# EAGLE schematic sch (EAGLE 7.4.0)
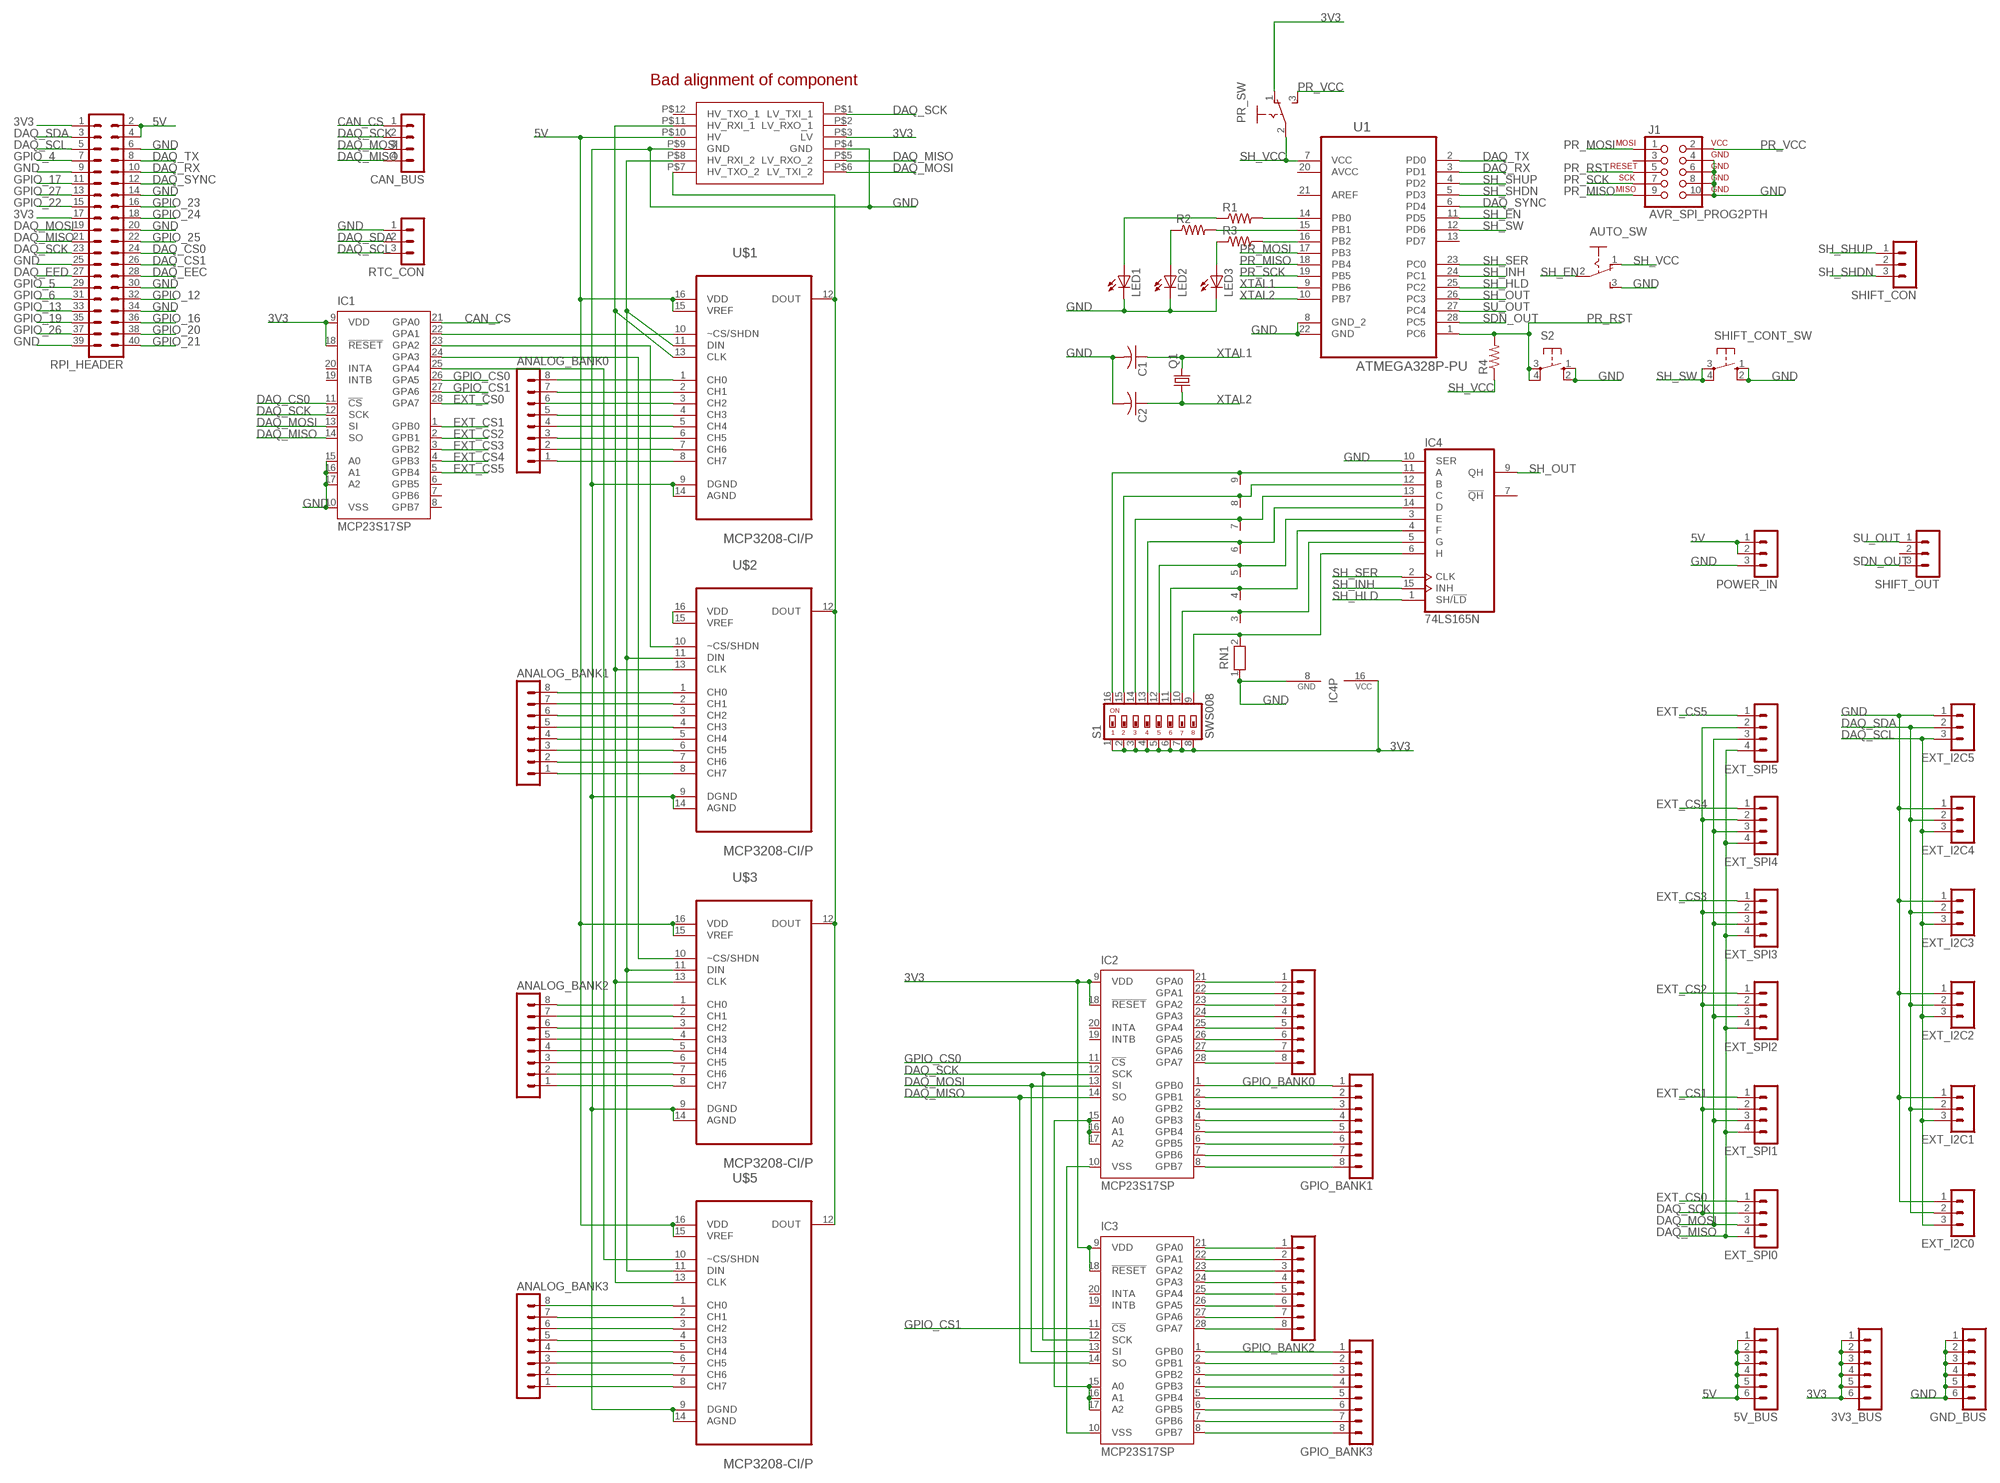
[diagram p0: schematic, sheet 1]

## Parts
3V3_BUS  MA06-1  [MA06-1]
5V_BUS  MA06-1  [MA06-1]
ANALOG_BANK0  MA08-1  [MA08-1]
ANALOG_BANK1  MA08-1  [MA08-1]
ANALOG_BANK2  MA08-1  [MA08-1]
ANALOG_BANK3  MA08-1  [MA08-1]
AUTO_SW  255SB  [255SB]
C1  C-US025-025X050  [C025-025X050]
C2  C-US025-025X050  [C025-025X050]
CAN_BUS  MA04-1  [MA04-1]
EXT_I2C0  MA03-1  [MA03-1]
EXT_I2C1  MA03-1  [MA03-1]
EXT_I2C2  MA03-1  [MA03-1]
EXT_I2C3  MA03-1  [MA03-1]
EXT_I2C4  MA03-1  [MA03-1]
EXT_I2C5  MA03-1  [MA03-1]
EXT_SPI0  MA04-1  [MA04-1]
EXT_SPI1  MA04-1  [MA04-1]
EXT_SPI2  MA04-1  [MA04-1]
EXT_SPI3  MA04-1  [MA04-1]
EXT_SPI4  MA04-1  [MA04-1]
EXT_SPI5  MA04-1  [MA04-1]
GND_BUS  MA06-1  [MA06-1]
GPIO_BANK0  MA08-1  [MA08-1]
GPIO_BANK1  MA08-1  [MA08-1]
GPIO_BANK2  MA08-1  [MA08-1]
GPIO_BANK3  MA08-1  [MA08-1]
IC1  MCP23S17SP  [DIL28-3]
IC2  MCP23S17SP  [DIL28-3]
IC3  MCP23S17SP  [DIL28-3]
IC4  74LS165N  [DIL16]
J1  AVR_SPI_PROG2PTH  [AVR_ICSP]
LED1  LED3MM  [LED3MM]
LED2  LED3MM  [LED3MM]
LED3  LED3MM  [LED3MM]
POWER_IN  MA03-1  [MA03-1]
PR_SW  255SB  [255SB]
Q1  CRYSTALHC49S  [HC49/S]
R1  R-US_0204/5  [0204/5]
R2  R-US_0204/5  [0204/5]
R3  R-US_0204/5  [0204/5]
R4  R-US_0204/5  [0204/5]
RN1  RN08  [RN-9]
RPI_HEADER  MA20-2  [MA20-2]
RTC_CON  MA03-1  [MA03-1]
S1  SWS008  [SMS-008]
S2  10-XX  [B3F-10XX]
SHIFT_CON  MA03-1  [MA03-1]
SHIFT_CONT_SW  10-XX  [B3F-10XX]
SHIFT_OUT  MA03-1  [MA03-1]
U1  ATMEGA328P-PU  [DIP254P762X457-28]
U$1  MCP3208-CI/P  [DIP254P762X432-16]
U$2  MCP3208-CI/P  [DIP254P762X432-16]
U$3  MCP3208-CI/P  [DIP254P762X432-16]
U$4  LOGIC_LEVEL_CONVERTER  [LOGIC_LEVEL_CONVERTER]
U$5  MCP3208-CI/P  [DIP254P762X432-16]

## Nets
3V3: 3V3_BUS.1 3V3_BUS.2 3V3_BUS.3 3V3_BUS.4 3V3_BUS.5 3V3_BUS.6 IC1.9(VDD) IC1.18(!RESET) IC2.9(VDD) IC2.18(!RESET) IC3.9(VDD) IC3.18(!RESET) IC4.16(VCC) PR_SW.1(O) RPI_HEADER.1 RPI_HEADER.17 S1.1 S1.2 S1.3 S1.4 S1.5 S1.6 S1.7 S1.8 U$4.P$3(LV)
5V: 5V_BUS.1 5V_BUS.2 5V_BUS.3 5V_BUS.4 5V_BUS.5 5V_BUS.6 POWER_IN.1 POWER_IN.2 RPI_HEADER.2 RPI_HEADER.4 U$1.15(VREF) U$1.16(VDD) U$3.15(VREF) U$3.16(VDD) U$4.P$10(HV) U$5.15(VREF) U$5.16(VDD)
CAN_CS: CAN_BUS.1 IC1.21(GPA0)
DAQ_CS0: IC1.11(!CS) RPI_HEADER.24
DAQ_CS1: RPI_HEADER.26
DAQ_EEC: RPI_HEADER.28
DAQ_EED: RPI_HEADER.27
DAQ_MISO: CAN_BUS.4 EXT_SPI0.4 EXT_SPI1.4 EXT_SPI2.4 EXT_SPI3.4 EXT_SPI4.4 EXT_SPI5.4 IC1.14(SO) IC2.14(SO) IC3.14(SO) RPI_HEADER.21 U$4.P$5(LV_RXO_2)
DAQ_MOSI: CAN_BUS.3 EXT_SPI0.3 EXT_SPI1.3 EXT_SPI2.3 EXT_SPI3.3 EXT_SPI4.3 EXT_SPI5.3 IC1.13(SI) IC2.13(SI) IC3.13(SI) RPI_HEADER.19 U$4.P$6(LV_TXI_2)
DAQ_RX: RPI_HEADER.10 U1.3(PD1)
DAQ_SCK: CAN_BUS.2 EXT_SPI0.2 EXT_SPI1.2 EXT_SPI2.2 EXT_SPI3.2 EXT_SPI4.2 EXT_SPI5.2 IC1.12(SCK) IC2.12(SCK) IC3.12(SCK) RPI_HEADER.23 U$4.P$1(LV_TXI_1)
DAQ_SCL: EXT_I2C0.3 EXT_I2C1.3 EXT_I2C2.3 EXT_I2C3.3 EXT_I2C4.3 EXT_I2C5.3 RPI_HEADER.5 RTC_CON.3
DAQ_SDA: EXT_I2C0.2 EXT_I2C1.2 EXT_I2C2.2 EXT_I2C3.2 EXT_I2C4.2 EXT_I2C5.2 RPI_HEADER.3 RTC_CON.2
DAQ_SYNC: RPI_HEADER.12 U1.6(PD4)
DAQ_TX: RPI_HEADER.8 U1.2(PD0)
EXT_CS0: EXT_SPI0.1 IC1.28(GPA7)
EXT_CS1: EXT_SPI1.1 IC1.1(GPB0)
EXT_CS2: EXT_SPI2.1 IC1.2(GPB1)
EXT_CS3: EXT_SPI3.1 IC1.3(GPB2)
EXT_CS4: EXT_SPI4.1 IC1.4(GPB3)
EXT_CS5: EXT_SPI5.1 IC1.5(GPB4)
GND: AUTO_SW.3(S) C1.2 C2.2 EXT_I2C0.1 EXT_I2C1.1 EXT_I2C2.1 EXT_I2C3.1 EXT_I2C4.1 EXT_I2C5.1 GND_BUS.1 GND_BUS.2 GND_BUS.3 GND_BUS.4 GND_BUS.5 GND_BUS.6 IC1.10(VSS) IC1.15(A0) IC1.16(A1) IC1.17(A2) IC4.8(GND) IC4.10(SER) J1.4(GND) J1.6(GND) J1.8(GND) J1.10(GND) LED1.K(C) LED2.K(C) LED3.K(C) POWER_IN.3 RN1.1 RPI_HEADER.6 RPI_HEADER.9 RPI_HEADER.14 RPI_HEADER.20 RPI_HEADER.25 RPI_HEADER.30 RPI_HEADER.34 RPI_HEADER.39 RTC_CON.1 S2.1(S) S2.2(S1) SHIFT_CONT_SW.1(S) SHIFT_CONT_SW.2(S1) U1.8(GND_2) U1.22(GND) U$1.9(DGND) U$1.14(AGND) U$2.9(DGND) U$2.14(AGND) U$3.9(DGND) U$3.14(AGND) U$4.P$4(GND) U$4.P$9(GND) U$5.9(DGND) U$5.14(AGND)
GPIO_4: RPI_HEADER.7
GPIO_5: RPI_HEADER.29
GPIO_6: RPI_HEADER.31
GPIO_12: RPI_HEADER.32
GPIO_13: RPI_HEADER.33
GPIO_16: RPI_HEADER.36
GPIO_17: RPI_HEADER.11
GPIO_19: RPI_HEADER.35
GPIO_20: RPI_HEADER.38
GPIO_21: RPI_HEADER.40
GPIO_22: RPI_HEADER.15
GPIO_23: RPI_HEADER.16
GPIO_24: RPI_HEADER.18
GPIO_25: RPI_HEADER.22
GPIO_26: RPI_HEADER.37
GPIO_27: RPI_HEADER.13
GPIO_CS0: IC1.26(GPA5) IC2.11(!CS)
GPIO_CS1: IC1.27(GPA6) IC3.11(!CS)
N$1: GPIO_BANK2.1 IC3.21(GPA0)
N$2: GPIO_BANK2.2 IC3.22(GPA1)
N$3: GPIO_BANK2.3 IC3.23(GPA2)
N$4: IC2.10(VSS) IC3.10(VSS)
N$5: U$2.15(VREF) U$2.16(VDD)
N$6: IC2.15(A0) IC2.16(A1) IC2.17(A2) IC3.15(A0) IC3.16(A1) IC3.17(A2)
N$7: IC1.22(GPA1) U$1.10(~CS/SHDN)
N$8: IC1.23(GPA2) U$2.10(~CS/SHDN)
N$9: IC1.24(GPA3) U$3.10(~CS/SHDN)
N$10: IC4.11(A) RN1.9 S1.16
N$11: IC4.12(B) RN1.8 S1.15
N$12: IC4.13(C) RN1.7 S1.14
N$13: IC4.14(D) RN1.6 S1.13
N$14: IC4.3(E) RN1.5 S1.12
N$15: IC4.4(F) RN1.4 S1.11
N$16: IC4.5(G) RN1.3 S1.10
N$17: IC4.6(H) RN1.2 S1.9
N$20: GPIO_BANK2.4 IC3.24(GPA3)
N$21: GPIO_BANK2.5 IC3.25(GPA4)
N$22: GPIO_BANK2.6 IC3.26(GPA5)
N$23: LED3.A R3.1
N$24: LED2.A R2.1
N$25: LED1.A R1.1
N$26: R1.2 U1.14(PB0)
N$27: R2.2 U1.15(PB1)
N$28: R3.2 U1.16(PB2)
N$29: GPIO_BANK2.7 IC3.27(GPA6)
N$30: U$1.12(DOUT) U$2.12(DOUT) U$3.12(DOUT) U$4.P$7(HV_TXO_2) U$5.12(DOUT)
N$31: U$1.11(DIN) U$2.11(DIN) U$3.11(DIN) U$4.P$8(HV_RXI_2) U$5.11(DIN)
N$32: U$1.13(CLK) U$2.13(CLK) U$3.13(CLK) U$4.P$11(HV_RXI_1) U$5.13(CLK)
N$33: GPIO_BANK2.8 IC3.28(GPA7)
N$34: GPIO_BANK3.1 IC3.1(GPB0)
N$35: GPIO_BANK3.2 IC3.2(GPB1)
N$36: IC1.25(GPA4) U$5.10(~CS/SHDN)
N$37: GPIO_BANK3.3 IC3.3(GPB2)
N$38: GPIO_BANK3.4 IC3.4(GPB3)
N$39: GPIO_BANK3.5 IC3.5(GPB4)
N$40: GPIO_BANK3.6 IC3.6(GPB5)
N$41: GPIO_BANK3.7 IC3.7(GPB6)
N$42: GPIO_BANK3.8 IC3.8(GPB7)
N$43: GPIO_BANK1.8 IC2.8(GPB7)
N$44: GPIO_BANK1.7 IC2.7(GPB6)
N$45: GPIO_BANK1.6 IC2.6(GPB5)
N$46: GPIO_BANK1.5 IC2.5(GPB4)
N$47: GPIO_BANK1.4 IC2.4(GPB3)
N$48: GPIO_BANK1.3 IC2.3(GPB2)
N$49: GPIO_BANK1.2 IC2.2(GPB1)
N$50: GPIO_BANK1.1 IC2.1(GPB0)
N$51: GPIO_BANK0.8 IC2.28(GPA7)
N$52: GPIO_BANK0.7 IC2.27(GPA6)
N$53: GPIO_BANK0.6 IC2.26(GPA5)
N$54: GPIO_BANK0.5 IC2.25(GPA4)
N$55: GPIO_BANK0.4 IC2.24(GPA3)
N$56: GPIO_BANK0.3 IC2.23(GPA2)
N$57: GPIO_BANK0.2 IC2.22(GPA1)
N$58: GPIO_BANK0.1 IC2.21(GPA0)
N$59: U$5.1(CH0)
N$60: ANALOG_BANK3.7 U$5.2(CH1)
N$61: ANALOG_BANK3.6 U$5.3(CH2)
N$62: ANALOG_BANK3.5 U$5.4(CH3)
N$63: ANALOG_BANK3.4 U$5.5(CH4)
N$64: ANALOG_BANK3.3 U$5.6(CH5)
N$65: ANALOG_BANK3.2 U$5.7(CH6)
N$66: ANALOG_BANK3.1 U$5.8(CH7)
N$67: ANALOG_BANK2.1 U$3.8(CH7)
N$68: ANALOG_BANK2.2 U$3.7(CH6)
N$69: ANALOG_BANK2.3 U$3.6(CH5)
N$70: ANALOG_BANK2.4 U$3.5(CH4)
N$71: ANALOG_BANK2.5 U$3.4(CH3)
N$72: ANALOG_BANK2.6 U$3.3(CH2)
N$73: ANALOG_BANK2.7 U$3.2(CH1)
N$74: ANALOG_BANK2.8 U$3.1(CH0)
N$75: ANALOG_BANK1.1 U$2.8(CH7)
N$76: ANALOG_BANK1.2 U$2.7(CH6)
N$77: ANALOG_BANK1.3 U$2.6(CH5)
N$78: ANALOG_BANK1.4 U$2.5(CH4)
N$79: ANALOG_BANK1.5 U$2.4(CH3)
N$80: ANALOG_BANK1.6 U$2.3(CH2)
N$81: ANALOG_BANK1.7 U$2.2(CH1)
N$82: ANALOG_BANK1.8 U$2.1(CH0)
N$83: ANALOG_BANK0.1 U$1.8(CH7)
N$84: ANALOG_BANK0.2 U$1.7(CH6)
N$85: ANALOG_BANK0.3 U$1.6(CH5)
N$86: ANALOG_BANK0.4 U$1.5(CH4)
N$87: ANALOG_BANK0.5 U$1.4(CH3)
N$88: U$1.3(CH2)
N$89: ANALOG_BANK0.7 U$1.2(CH1)
N$90: ANALOG_BANK0.8 U$1.1(CH0)
PR_MISO: J1.9(MISO) U1.18(PB4)
PR_MOSI: J1.1(MOSI) U1.17(PB3)
PR_RST: J1.5(RESET) R4.2 S2.3(P) S2.4(P1) U1.1(PC6)
PR_SCK: J1.7(SCK) U1.19(PB5)
PR_VCC: J1.2(VCC) PR_SW.3(S)
SDN_OUT: SHIFT_OUT.3 U1.28(PC5)
SH_EN: AUTO_SW.2(P) U1.11(PD5)
SH_HLD: IC4.1(SH/!LD) U1.25(PC2)
SH_INH: IC4.15(INH) U1.24(PC1)
SH_OUT: IC4.9(QH) U1.26(PC3)
SH_SER: IC4.2(CLK) U1.23(PC0)
SH_SHDN: SHIFT_CON.3 U1.5(PD3)
SH_SHUP: SHIFT_CON.1 U1.4(PD2)
SH_SW: SHIFT_CONT_SW.3(P) SHIFT_CONT_SW.4(P1) U1.12(PD6)
SH_VCC: AUTO_SW.1(O) PR_SW.2(P) R4.1 U1.7(VCC)
SU_OUT: SHIFT_OUT.1 U1.27(PC4)
XTAL1: C1.1 Q1.2 U1.9(PB6)
XTAL2: C2.1 Q1.1 U1.10(PB7)
Unconnected: ANALOG_BANK0.6 ANALOG_BANK3.8 IC1.6(GPB5) IC1.7(GPB6) IC1.8(GPB7) IC1.19(INTB) IC1.20(INTA) IC2.19(INTB) IC2.20(INTA) IC3.19(INTB) IC3.20(INTA) IC4.7(!QH) J1.3(NC) SHIFT_CON.2 SHIFT_OUT.2 U1.13(PD7) U1.21(AREF) U$4.P$2(LV_RXO_1) U$4.P$12(HV_TXO_1)

## Notes on the sheet
- Bad alignment of component

## Power pins joined to a net without a drawn wire
AVCC: U1.20(AVCC)

## Library data of the parts
3V3_BUS 5V_BUS GND_BUS = con-lstb:MA06-1: PIN HEADER; OC_FARNELL: unknown; OC_NEWARK: unknown
ANALOG_BANK0 ANALOG_BANK1-ANALOG_BANK3 GPIO_BANK0 GPIO_BANK1-GPIO_BANK3 = con-lstb:MA08-1: PIN HEADER; OC_FARNELL: unknown; OC_NEWARK: unknown
AUTO_SW PR_SW = switch:255SB: SLIDING SWITCH Distributor Buerklin, 11G810
C1 C2 = rcl:C-US: CAPACITOR, American symbol
CAN_BUS EXT_SPI0 EXT_SPI1-EXT_SPI5 = con-lstb:MA04-1: PIN HEADER; OC_FARNELL: unknown; OC_NEWARK: unknown
EXT_I2C0 EXT_I2C1-EXT_I2C5 POWER_IN RTC_CON SHIFT_CON SHIFT_OUT = con-lstb:MA03-1: PIN HEADER; OC_FARNELL: unknown; OC_NEWARK: unknown
IC1-IC3 = microchip:MCP23S17: http://ww1.microchip.com/downloads/en/DeviceDoc/21952a.pdf Source: http://ww1.microchip.com/downloads/en/DeviceDoc/21952a.pdf; MF: MICROCHIP; MPN: MCP23S17-E/SP; OC_FARNELL: 1292238; OC_NEWARK: 31K2951
IC4 = 74xx-us:74*165: 8-bit parallel load SHIFT REGISTER
J1 = SparkFun-Connectors:AVR_SPI_PROG2: AVR 10-pin ICSP Header This is the standard AVR In Circuit Serial Programming header. Minimal, but includes pin one indicator. Works with standard Olimex programmers. Also look for the 6-pin reduced version. Spark Fun Electronics SKU: PRT-00778
LED1-LED3 = led:LED: LED OSRAM: - CHIPLED LG R971, LG N971, LY N971, LG Q971, LY Q971, LO R971, LY R971 LH N974, LH R974 LS Q976, LO Q976, LY Q976 LO Q996 - Hyper CHIPLED LW Q18S LB Q993, LB Q99A, LB R99A - SideLED LS A670, LO A670, LY A670, LG A670, LP A670 LB A673, LV A673, LT A673, LW A673 LH A674 LY A675 LS A676, LA A676, LO A676, LY A676, LW A676 LS A679, LY A679, LG A679 - Hyper Micro SIDELED® LS Y876, LA Y876, LO Y876, LY Y876 LT Y87S - SmartLED LW L88C, LW L88S LB L89C, LB L89S, LG L890 LS L89K, LO L89K, LY L89K LS L896, LA L896, LO L896, LY L896 - TOPLED LS T670, LO T670, LY T670, LG T670, LP T670 LSG T670, LSP T670, LSY T670, LOP T670, LYG T670 LG T671, LOG T671, LSG T671 LB T673, LV T673, LT T673, LW T673 LH T674 LS T676, LA T676, LO T676, LY T676, LB T676, LH T676, LSB T676, LW T676 LB T67C, LV T67C, LT T67C, LS T67K, LO T67K, LY T67K, LW E67C LS E67B, LA E67B, LO E67B, LY E67B, LB E67C, LV E67C, LT E67C LW T67C LS T679, LY T679, LG T679 LS T770, LO T770, LY T770, LG T770, LP T770 LB T773, LV T773, LT T773, LW T773 LH T774 LS E675, LA E675, LY E675, LS T675 LS T776, LA T776, LO T776, LY T776, LB T776 LHGB T686 LT T68C, LB T68C - Hyper Mini TOPLED® LB M676 - Mini TOPLED Santana® LG M470 LS M47K, LO M47K, LY M47K Source: http://www.osram.convergy.de LUXEON: - LUMILED® LXK2-PW12-R00, LXK2-PW12-S00, LXK2-PW14-U00, LXK2-PW14-V00 LXK2-PM12-R00, LXK2-PM12-S00, LXK2-PM14-U00 LXK2-PE12-Q00, LXK2-PE12-R00, LXK2-PE12-S00, LXK2-PE14-T00, LXK2-PE14-U00 LXK2-PB12-K00, LXK2-PB12-L00, LXK2-PB12-M00, LXK2-PB14-N00, LXK2-PB14-P00, LXK2-PB14-Q00 LXK2-PR12-L00, LXK2-PR12-M00, LXK2-PR14-Q00, LXK2-PR14-R00 LXK2-PD12-Q00, LXK2-PD12-R00, LXK2-PD12-S00 LXK2-PH12-R00, LXK2-PH12-S00 LXK2-PL12-P00, LXK2-PL12-Q00, LXK2-PL12-R00 Source: www.luxeon.com KINGBRIGHT: KA-3528ASYC Source: www.kingbright.com
Q1 = crystal:CRYSTAL: CRYSTAL; OC_FARNELL: 1667008; OC_NEWARK: unknown
R1-R4 = rcl:R-US_: RESISTOR, American symbol
RN1 = resistor-net:RN08: RESISTOR NETWORK; OC_FARNELL: unknown; OC_NEWARK: unknown
RPI_HEADER = con-lstb:MA20-2: PIN HEADER; OC_FARNELL: unknown; OC_NEWARK: unknown
S1 = smd-special:SWS008: SMD Dip Switch 8 pol.
S2 SHIFT_CONT_SW = switch-omron:10-XX: OMRON SWITCH; MPN: B3F-1000; OC_FARNELL: 176432; OC_NEWARK: 36M3542
U1 = Atmel_By_element14_Batch_1-00:ATMEGA328P-PU: 8-bit Microcontroller with In-System Programmable Flash; MPN: ATMEGA328P-PU; OC_FARNELL: 1715487; OC_NEWARK: 15R0268; PACKAGE: PDIP-28; SUPPLIER: Atmel
U$1-U$3 U$5 = Microchip_By_element14_Batch_1:MCP3208-CI/P: A/D Converters; MPN: MCP3208-CI/P; OC_FARNELL: 1084269; OC_NEWARK: 58K1815; PACKAGE: DIP-16; SUPPLIER: Microchip
U$4 = SparkFun-Boards:LOGIC_LEVEL_CONVERTER: Logic Level Converter (3.3v - 5v) https://www.sparkfun.com/products/8745